# Altium schematic sheet 0264_GPU_VCCGT VREG PHA.SchDoc
size 848 x 558 mm
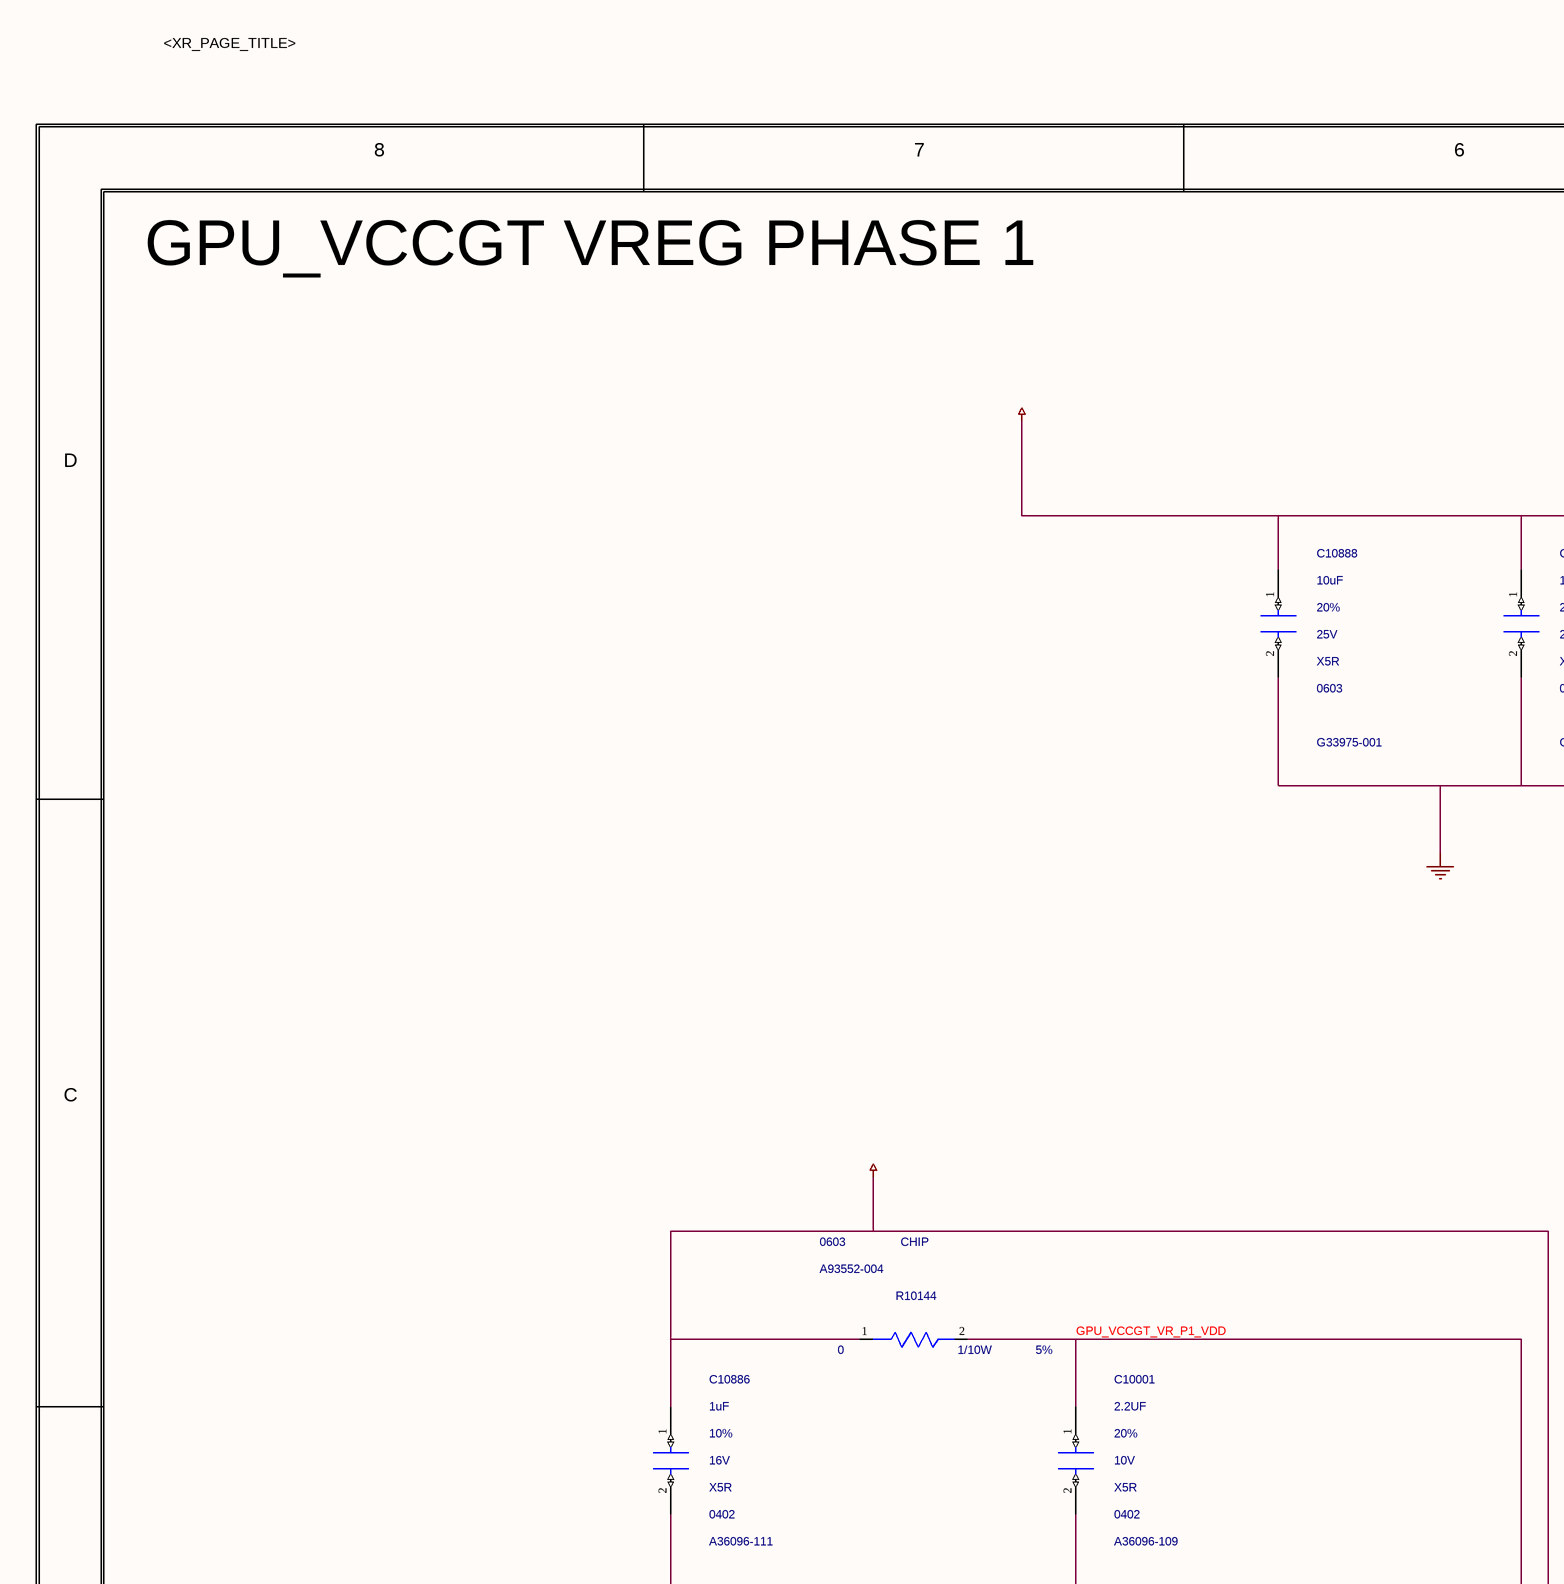
[diagram p0: 0264_GPU_VCCGT VREG PHA.SchDoc, top left]
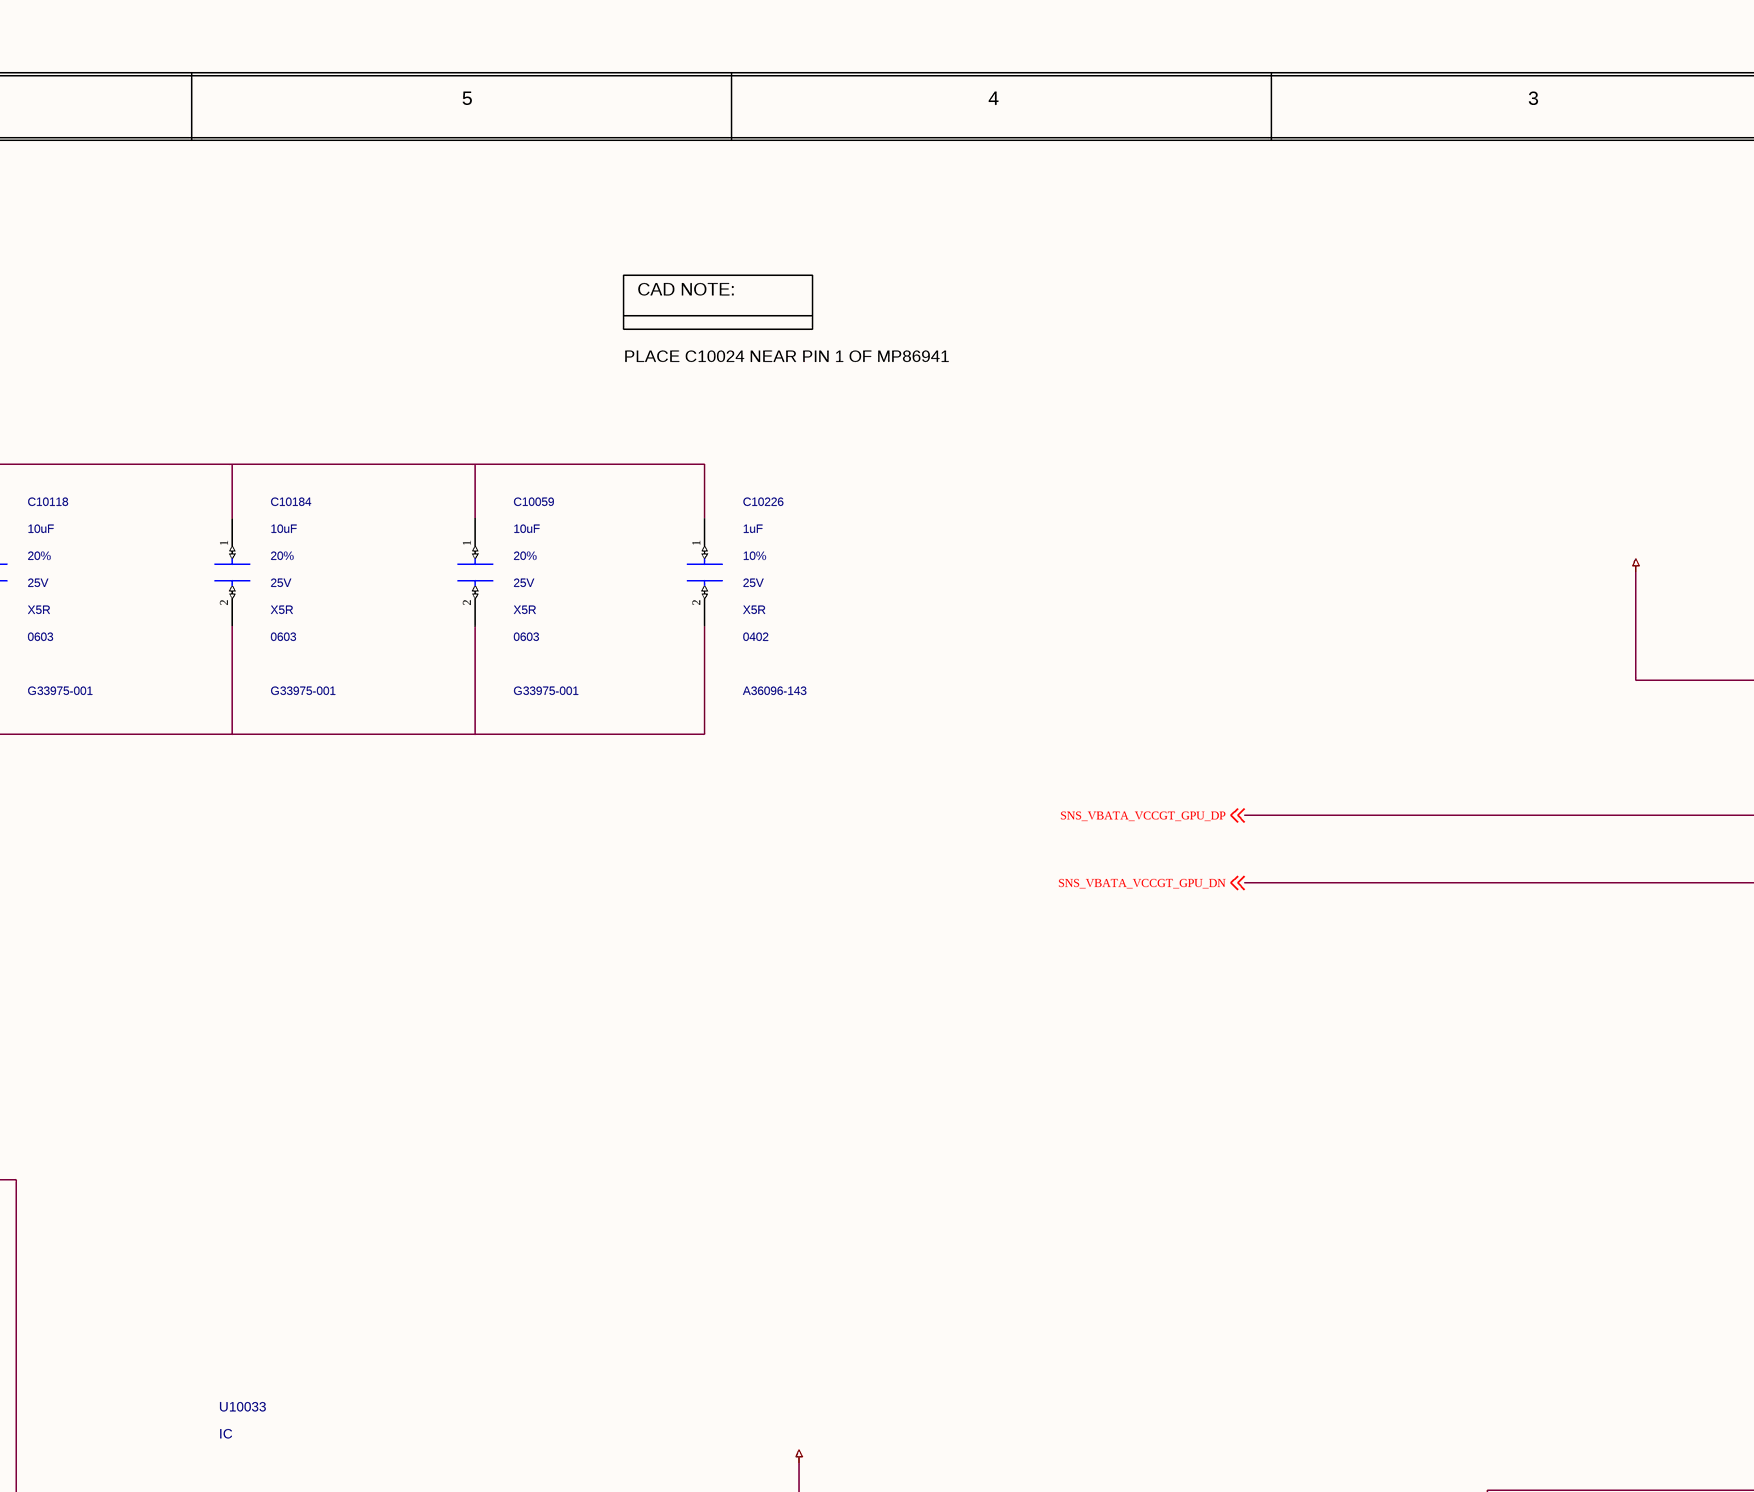
[diagram p1: 0264_GPU_VCCGT VREG PHA.SchDoc, top middle]
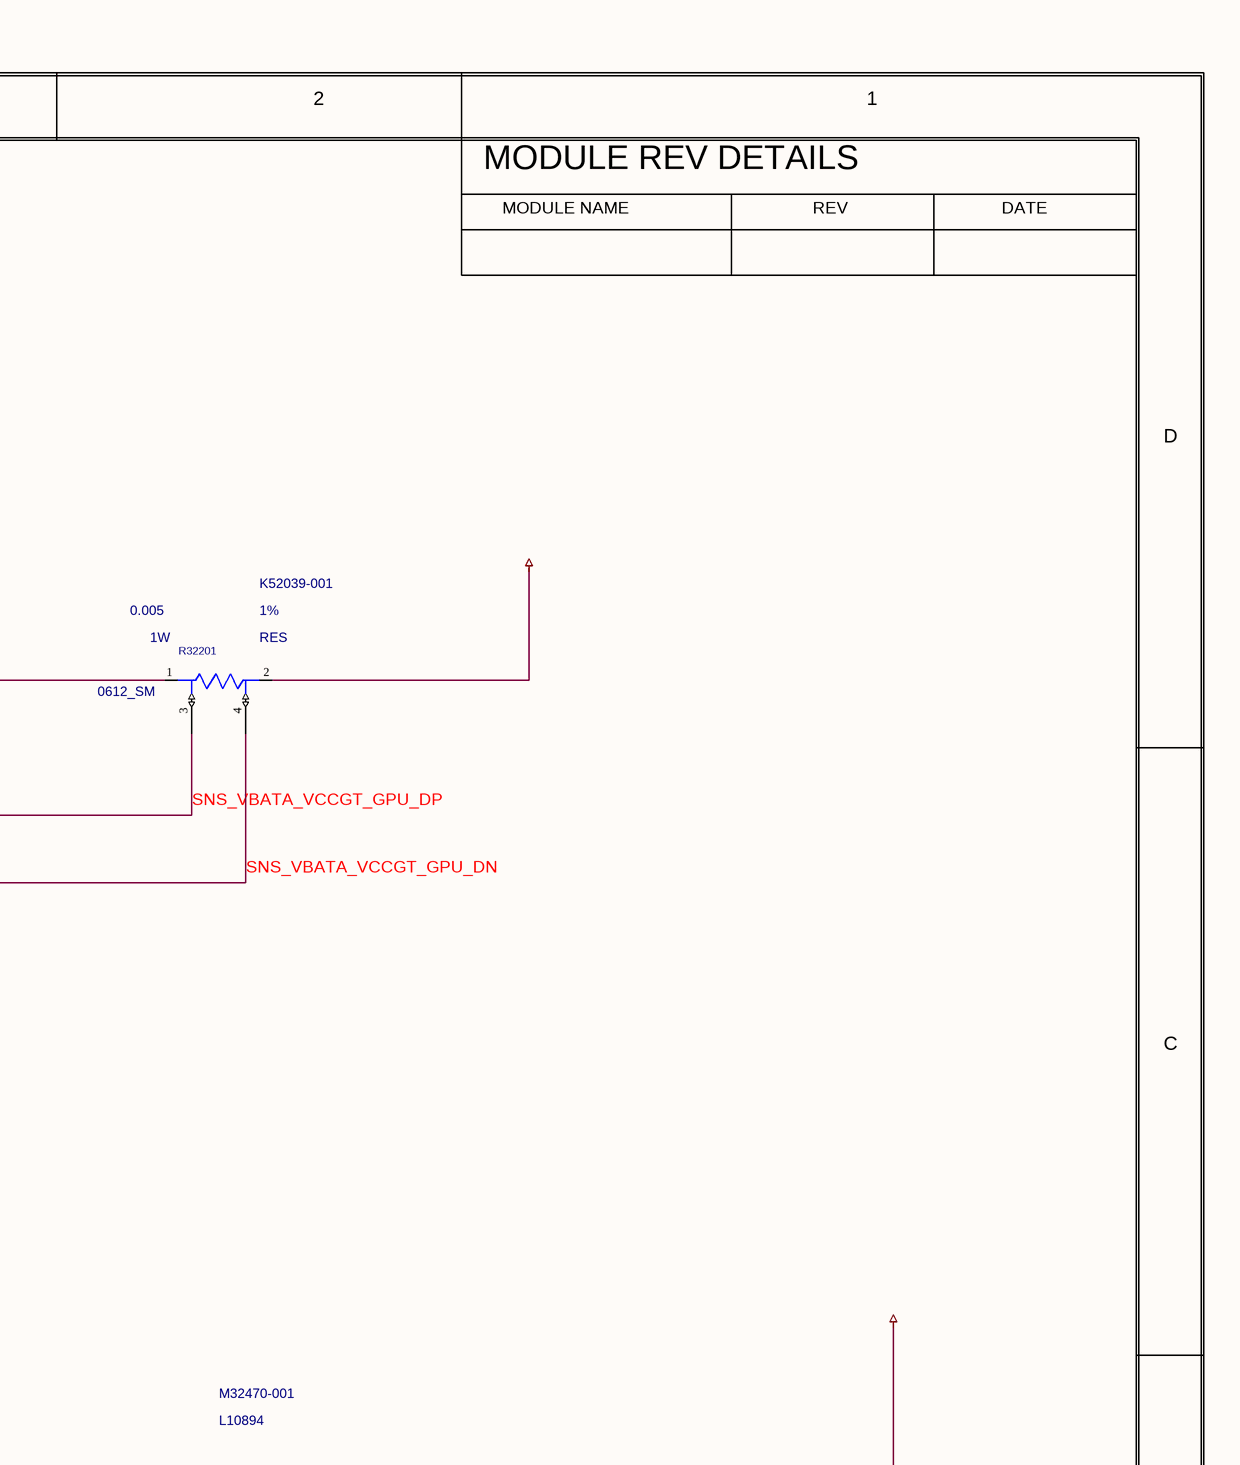
[diagram p2: 0264_GPU_VCCGT VREG PHA.SchDoc, top right]
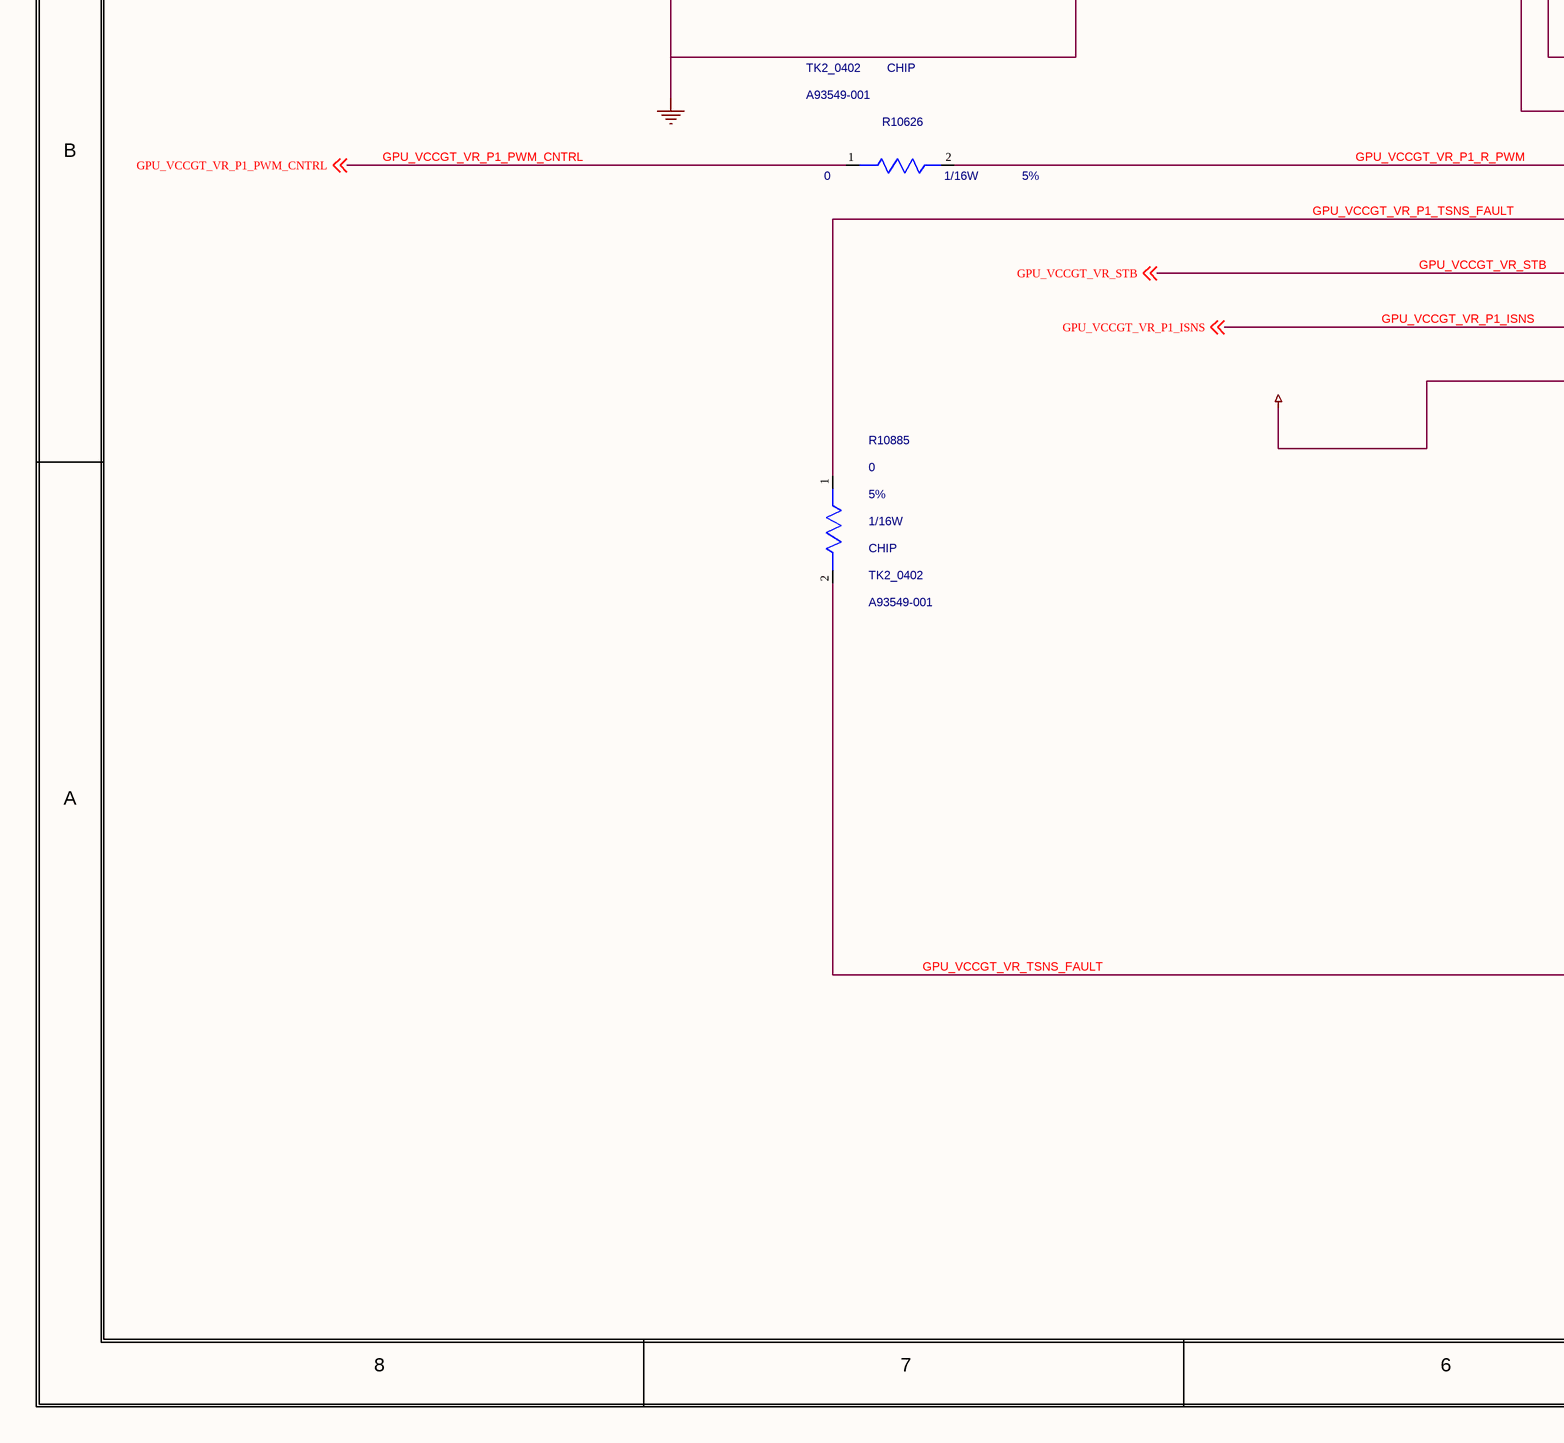
[diagram p3: 0264_GPU_VCCGT VREG PHA.SchDoc, bottom left]
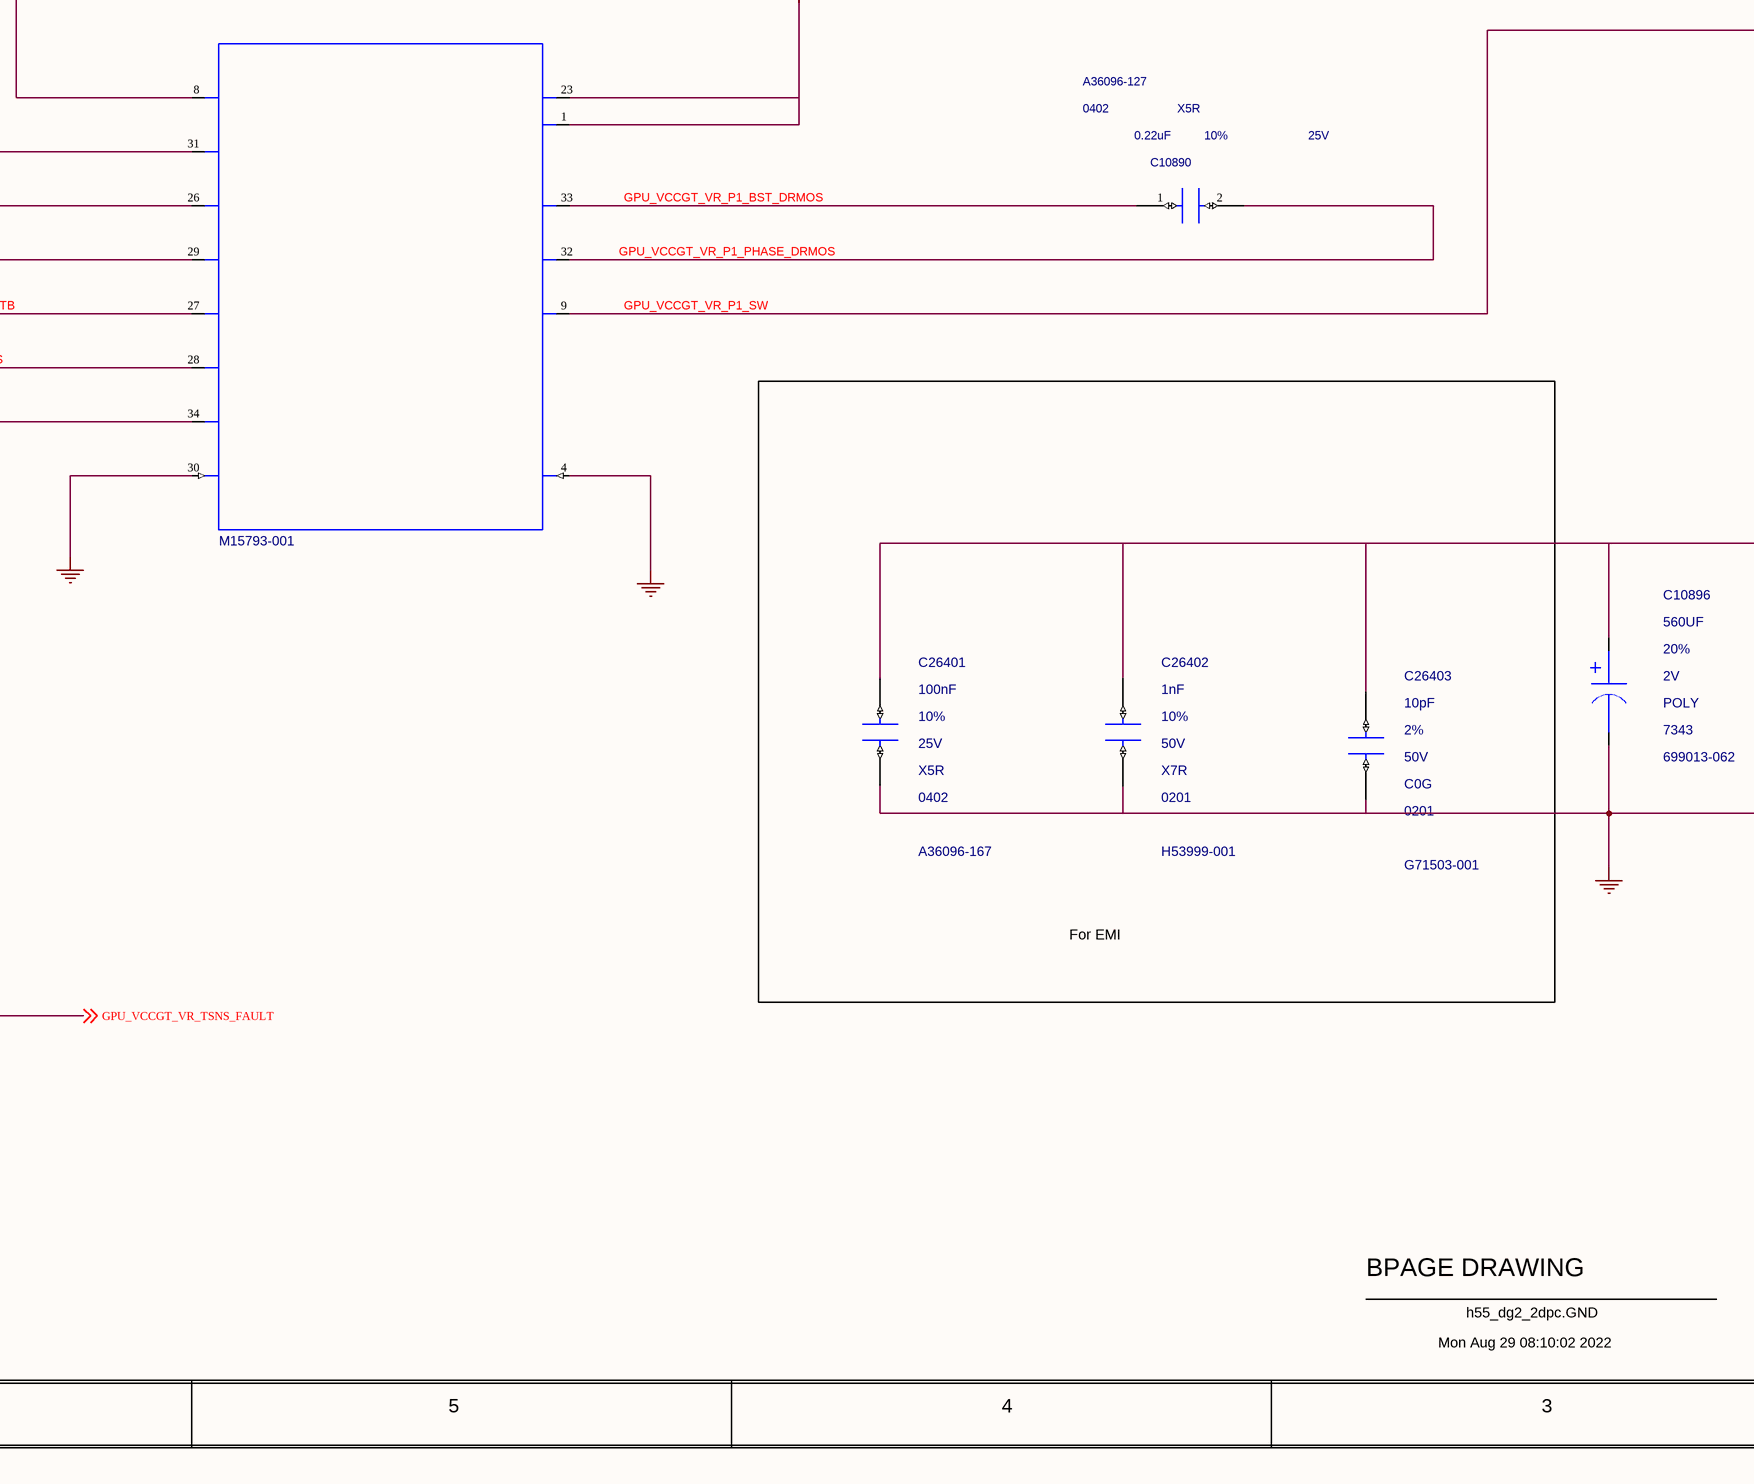
[diagram p4: 0264_GPU_VCCGT VREG PHA.SchDoc, bottom middle]
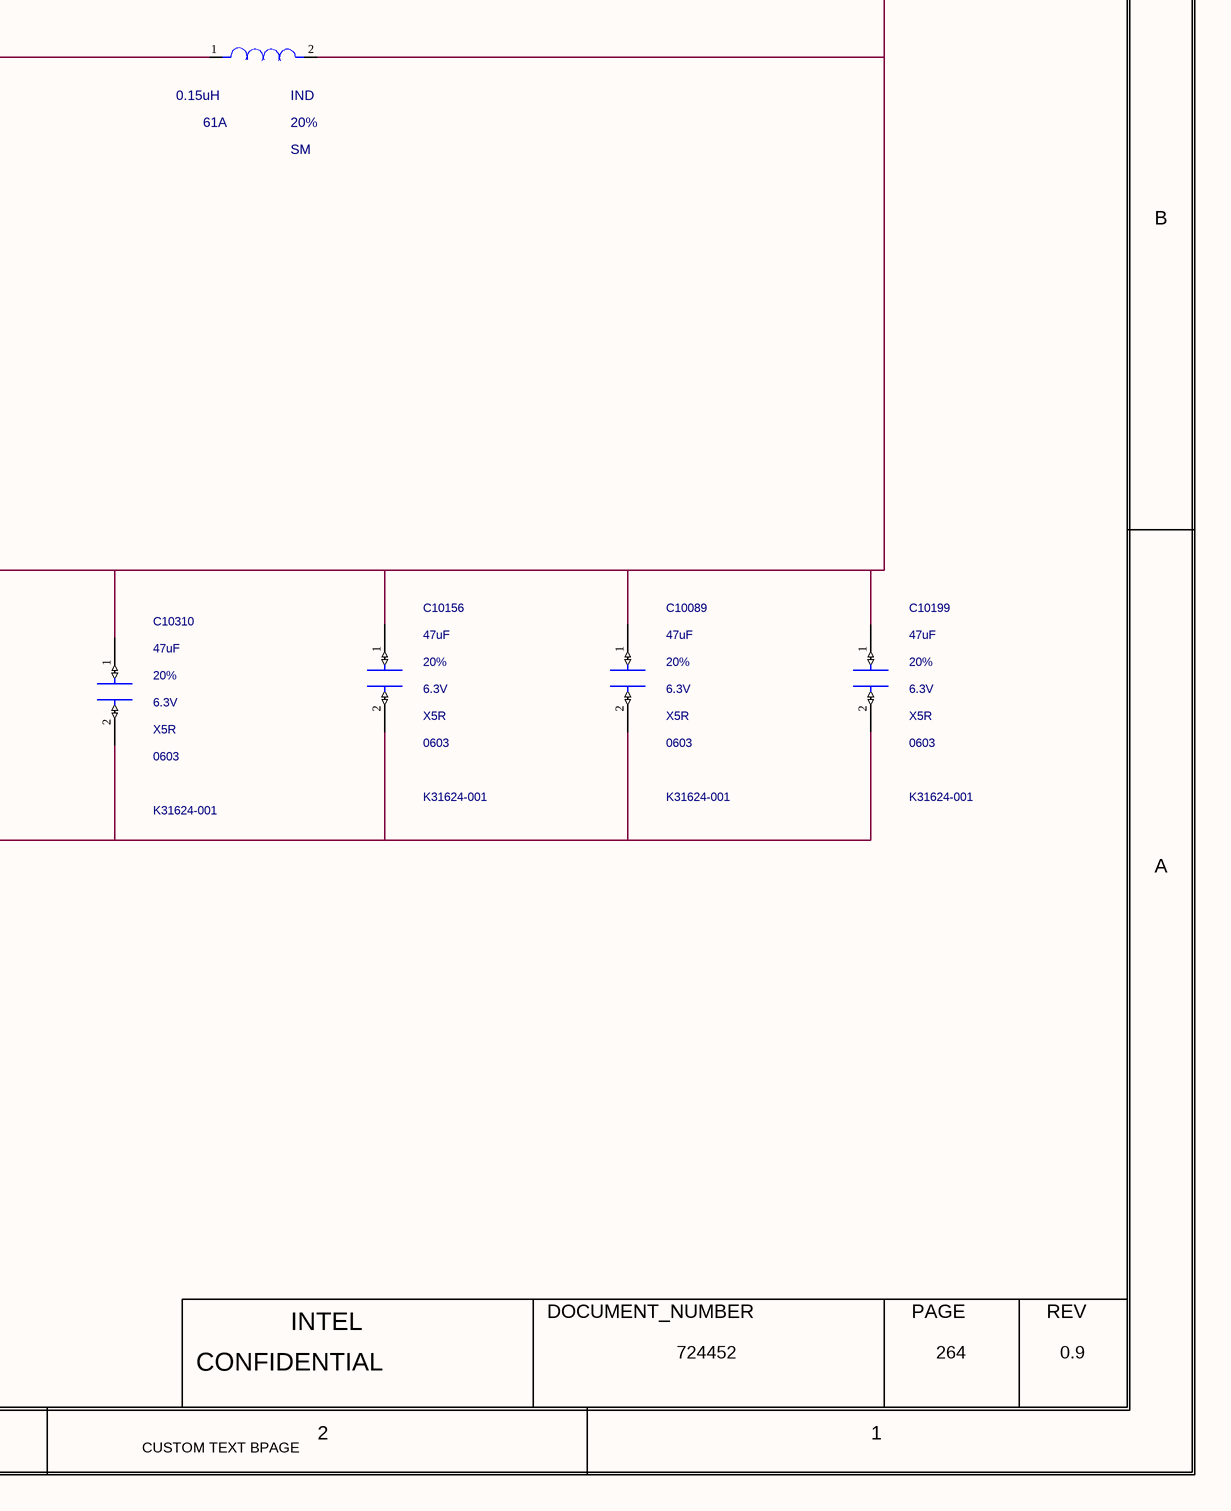
[diagram p5: 0264_GPU_VCCGT VREG PHA.SchDoc, bottom right]

## Parts
C10001  2.2UF  MATERIAL: X5R  PACK_TYPE: 0402  PART_NUMBER: A36096-109  TOLERANCE: 20%  VOLTAGE: 10V  [SMC0402IA]
C10059  10uF  MATERIAL: X5R  PACK_TYPE: 0603  PART_NUMBER: G33975-001  TOLERANCE: 20%  VOLTAGE: 25V  [SMC0603IA]
C10089  47uF  MATERIAL: X5R  PACK_TYPE: 0603  PART_NUMBER: K31624-001  TOLERANCE: 20%  VOLTAGE: 6.3V  [SMC0603ID]
C10118  10uF  MATERIAL: X5R  PACK_TYPE: 0603  PART_NUMBER: G33975-001  TOLERANCE: 20%  VOLTAGE: 25V  [SMC0603IA]
C10156  47uF  MATERIAL: X5R  PACK_TYPE: 0603  PART_NUMBER: K31624-001  TOLERANCE: 20%  VOLTAGE: 6.3V  [SMC0603ID]
C10184  10uF  MATERIAL: X5R  PACK_TYPE: 0603  PART_NUMBER: G33975-001  TOLERANCE: 20%  VOLTAGE: 25V  [SMC0603IA]
C10199  47uF  MATERIAL: X5R  PACK_TYPE: 0603  PART_NUMBER: K31624-001  TOLERANCE: 20%  VOLTAGE: 6.3V  [SMC0603ID]
C10226  1uF  MATERIAL: X5R  PACK_TYPE: 0402  PART_NUMBER: A36096-143  TOLERANCE: 10%  VOLTAGE: 25V  [SMC0402MA]
C10310  47uF  MATERIAL: X5R  PACK_TYPE: 0603  PART_NUMBER: K31624-001  TOLERANCE: 20%  VOLTAGE: 6.3V  [SMC0603ID]
C10886  1uF  MATERIAL: X5R  PACK_TYPE: 0402  PART_NUMBER: A36096-111  TOLERANCE: 10%  VOLTAGE: 16V  [SMC0402IA]
C10888  10uF  MATERIAL: X5R  PACK_TYPE: 0603  PART_NUMBER: G33975-001  TOLERANCE: 20%  VOLTAGE: 25V  [SMC0603IA]
C10890  0.22uF  MATERIAL: X5R  PACK_TYPE: 0402  PART_NUMBER: A36096-127  TOLERANCE: 10%  VOLTAGE: 25V  [SMC1005MB]
C10896  560UF  MATERIAL: POLY  PACK_TYPE: 7343  PART_NUMBER: 699013-062  TOLERANCE: 20%  VOLTAGE: 2V  [CTK0_SMC7343M_7500X4500_TANT_MA]
C26401  100nF  MATERIAL: X5R  PACK_TYPE: 0402  PART_NUMBER: A36096-167  TOLERANCE: 10%  VOLTAGE: 25V  [CTK2_SM0402_1050X550_MA]
C26402  1nF  MATERIAL: X7R  PACK_TYPE: 0201  PART_NUMBER: H53999-001  TOLERANCE: 10%  VOLTAGE: 50V  [CTK2_SM0201_630X330_MA]
C26403  10pF  MATERIAL: C0G  PACK_TYPE: 0201  PART_NUMBER: G71503-001  TOLERANCE: 2%  VOLTAGE: 50V  [CTK2_SM0201_630X330_MA]
L10894  0.15uH  CURRENT: 61A  MATERIAL: IND  PACK_TYPE: SM  PART_NUMBER: M32470-001  TOLERANCE: 20%  [CTK2_SM_7300X6800_MA]
R10144  0  MATERIAL: CHIP  PACK_TYPE: 0603  PART_NUMBER: A93552-004  TOLERANCE: 5%  WATTAGE: 1/10W  [SMR0603IA]
R10626  0  MATERIAL: CHIP  PACK_TYPE: TK2_0402  PART_NUMBER: A93549-001  TOLERANCE: 5%  WATTAGE: 1/16W  [SMR1005MB]
R10885  0  MATERIAL: CHIP  PACK_TYPE: TK2_0402  PART_NUMBER: A93549-001  TOLERANCE: 5%  WATTAGE: 1/16W  [SMR1005MB]
R32201  0.005  MATERIAL: RES  PACK_TYPE: 0612_SM  PART_NUMBER: K52039-001  TOLERANCE: 1%  WATTAGE: 1W  [CTK0_SMR4_0612_1800X3450_MB_VR]
U10033  MATERIAL: IC  PART_NUMBER: M15793-001  [CTK1_LCC34_4100X6100_450_DF4P_MA_VR]  (hidden comment: C_MP86959)

## Blocks framed on the sheet
For EMI: C26401-C26403

## Nets
+V3P3S_GPU: C10886.1(A) R10144.1(A) U10033.8(VDRV) U10033.34(TEST)
+VBATA_DG2: R32201.1(PWRA)
+VBATA_VCCGT_GPU: C10059.1(A) C10118.1(A) C10184.1(A) C10226.1(A) C10888.1(A) R32201.2(PWRB) U10033.1(VIN_1) U10033.23(VIN_2)
+VCCGT_GPU: C10089.1(A) C10156.1(A) C10199.1(A) C10310.1(A) C10896.1(A) C26401.1(A) C26402.1(A) C26403.1(A) L10894.2(INB)
GND: C10001.2(B) C10059.2(B) C10089.2(B) C10118.2(B) C10156.2(B) C10184.2(B) C10199.2(B) C10226.2(B) C10310.2(B) C10886.2(B) C10888.2(B) C10896.2(B) C26401.2(B) C26402.2(B) C26403.2(B) U10033.4(PGND) U10033.30(AGND)
GPU_VCCGT_VR_P1_BST_DRMOS: C10890.1(A) U10033.33(BST)
GPU_VCCGT_VR_P1_ISNS: U10033.28(CS) ; off-sheet GPU_VCCGT_VR_P1_ISNS
GPU_VCCGT_VR_P1_PHASE_DRMOS: C10890.2(B) U10033.32(PHASE)
GPU_VCCGT_VR_P1_PWM_CNTRL: R10626.1(A) ; off-sheet GPU_VCCGT_VR_P1_PWM_CNTRL
GPU_VCCGT_VR_P1_R_PWM: R10626.2(B) U10033.26(PWM)
GPU_VCCGT_VR_P1_SW: L10894.1(INA) U10033.9(SW)
GPU_VCCGT_VR_P1_TSNS_FAULT: R10885.1(A) U10033.29(VTEMP_FLT)
GPU_VCCGT_VR_P1_VDD: C10001.1(A) R10144.2(B) U10033.31(VDD)
GPU_VCCGT_VR_STB: U10033.27(SYNC) ; off-sheet GPU_VCCGT_VR_STB
GPU_VCCGT_VR_TSNS_FAULT: R10885.2(B) ; off-sheet GPU_VCCGT_VR_TSNS_FAULT
SNS_VBATA_VCCGT_GPU_DN: R32201.4(SENB) ; off-sheet SNS_VBATA_VCCGT_GPU_DN
SNS_VBATA_VCCGT_GPU_DP: R32201.3(SENA) ; off-sheet SNS_VBATA_VCCGT_GPU_DP

## Notes on the sheet
- <XR_PAGE_TITLE>
- 8
- 7
- 6
- 5
- 4
- 3
- 2
- 1
- MODULE REV DETAILS
- GPU_VCCGT VREG PHASE 1
- MODULE NAME
- REV
- DATE
- CAD NOTE:
- PLACE C10024 NEAR PIN 1 OF MP86941
- D
- C
- B
- A
- BPAGE DRAWING
- INTEL
- DOCUMENT_NUMBER
- PAGE
- Mon Aug 29 08:10:02 2022
- h55_dg2_2dpc.GND
- CONFIDENTIAL
- 724452
- 264
- 0.9
- CUSTOM TEXT BPAGE

## Library data of the parts
C10001 = CAP: CDS_PHYS_PART_NAME: CAP_0402-A36096-109,X5R,2.2UF,10V,20%,LPDB,GENERIC; OriginalSymbolOrigin: (-50,25); XY: (-6200,2650); VER: 1; ROT: 0; PHYS_PAGE: 264; LOCATION: C10001; DRAWING: @RVP1_ADL_SB_ADP_S_DDR5_SODIMM_2DPC_LIB.H55_DG2_2DPC(SCH_1):PAGE437; CDS_LIB: discrete; PCB Footprint: SMC0402IA; CHIPS_PART_NAME: CAP; CDS_PART_NAME: CAP_0402-A36096-109,X5R,2.2UF,10V,20%,LPDB,GENERIC; CDS_LOCATION: C10001
C10059 = CAP: CDS_PHYS_PART_NAME: CAP_0603-G33975-001,X5R,10UF,25V,20%,LPDB,GENERIC; OriginalSymbolOrigin: (-50,25); XY: (-4475,4200); VER: 1; ROT: 0; PHYS_PAGE: 264; LOCATION: C10059; DRAWING: @RVP1_ADL_SB_ADP_S_DDR5_SODIMM_2DPC_LIB.H55_DG2_2DPC(SCH_1):PAGE437; CDS_LIB: discrete; PCB Footprint: SMC0603IA; CHIPS_PART_NAME: CAP; CDS_PART_NAME: CAP_0603-G33975-001,X5R,10UF,25V,20%,LPDB,GENERIC; CDS_LOCATION: C10059
C10089 = CAP: CDS_PHYS_PART_NAME: CAP_0603-K31624-001,X5R,47UF,6.3V,20%,LPDB,GENERIC; OriginalSymbolOrigin: (-50,25); XY: (-925,1350); VER: 1; ROT: 0; PHYS_PAGE: 264; LOCATION: C10089; DRAWING: @RVP1_ADL_SB_ADP_S_DDR5_SODIMM_2DPC_LIB.H55_DG2_2DPC(SCH_1):PAGE437; CDS_LIB: discrete; PCB Footprint: SMC0603ID; CHIPS_PART_NAME: CAP; CDS_PART_NAME: CAP_0603-K31624-001,X5R,47UF,6.3V,20%,LPDB,GENERIC; CDS_LOCATION: C10089
C10118 = CAP: CDS_PHYS_PART_NAME: CAP_0603-G33975-001,X5R,10UF,25V,20%,LPDB,GENERIC; OriginalSymbolOrigin: (-50,25); XY: (-5375,4200); VER: 1; ROT: 0; PHYS_PAGE: 264; LOCATION: C10118; DRAWING: @RVP1_ADL_SB_ADP_S_DDR5_SODIMM_2DPC_LIB.H55_DG2_2DPC(SCH_1):PAGE437; CDS_LIB: discrete; PCB Footprint: SMC0603IA; CHIPS_PART_NAME: CAP; CDS_PART_NAME: CAP_0603-G33975-001,X5R,10UF,25V,20%,LPDB,GENERIC; CDS_LOCATION: C10118
C10156 = CAP: CDS_PHYS_PART_NAME: CAP_0603-K31624-001,X5R,47UF,6.3V,20%,LPDB,GENERIC; OriginalSymbolOrigin: (-50,25); XY: (-1375,1350); VER: 1; ROT: 0; PHYS_PAGE: 264; LOCATION: C10156; DRAWING: @RVP1_ADL_SB_ADP_S_DDR5_SODIMM_2DPC_LIB.H55_DG2_2DPC(SCH_1):PAGE437; CDS_LIB: discrete; PCB Footprint: SMC0603ID; CHIPS_PART_NAME: CAP; CDS_PART_NAME: CAP_0603-K31624-001,X5R,47UF,6.3V,20%,LPDB,GENERIC; CDS_LOCATION: C10156
C10184 = CAP: CDS_PHYS_PART_NAME: CAP_0603-G33975-001,X5R,10UF,25V,20%,LPDB,GENERIC; OriginalSymbolOrigin: (-50,25); XY: (-4925,4200); VER: 1; ROT: 0; PHYS_PAGE: 264; LOCATION: C10184; DRAWING: @RVP1_ADL_SB_ADP_S_DDR5_SODIMM_2DPC_LIB.H55_DG2_2DPC(SCH_1):PAGE437; CDS_LIB: discrete; PCB Footprint: SMC0603IA; CHIPS_PART_NAME: CAP; CDS_PART_NAME: CAP_0603-G33975-001,X5R,10UF,25V,20%,LPDB,GENERIC; CDS_LOCATION: C10184
C10199 = CAP: CDS_PHYS_PART_NAME: CAP_0603-K31624-001,X5R,47UF,6.3V,20%,LPDB,GENERIC; OriginalSymbolOrigin: (-50,25); XY: (-475,1350); VER: 1; ROT: 0; PHYS_PAGE: 264; LOCATION: C10199; DRAWING: @RVP1_ADL_SB_ADP_S_DDR5_SODIMM_2DPC_LIB.H55_DG2_2DPC(SCH_1):PAGE437; CDS_LIB: discrete; PCB Footprint: SMC0603ID; CHIPS_PART_NAME: CAP; CDS_PART_NAME: CAP_0603-K31624-001,X5R,47UF,6.3V,20%,LPDB,GENERIC; CDS_LOCATION: C10199
C10226 = CAP: CDS_PHYS_PART_NAME: CAP_0402-A36096-143,X5R,1UF,25V,10%,LPDB,GENERIC; OriginalSymbolOrigin: (-50,25); XY: (-4050,4200); VER: 1; ROT: 0; PHYS_PAGE: 264; LOCATION: C10226; DRAWING: @RVP1_ADL_SB_ADP_S_DDR5_SODIMM_2DPC_LIB.H55_DG2_2DPC(SCH_1):PAGE437; CDS_LIB: discrete; PCB Footprint: SMC0402MA; CHIPS_PART_NAME: CAP; CDS_PART_NAME: CAP_0402-A36096-143,X5R,1UF,25V,10%,LPDB,GENERIC; CDS_LOCATION: C10226
C10310 = CAP: CDS_PHYS_PART_NAME: CAP_0603-K31624-001,X5R,47UF,6.3V,20%,LPDB,GENERIC; OriginalSymbolOrigin: (-50,25); XY: (-1875,1325); VER: 1; ROT: 0; PHYS_PAGE: 264; LOCATION: C10310; DRAWING: @RVP1_ADL_SB_ADP_S_DDR5_SODIMM_2DPC_LIB.H55_DG2_2DPC(SCH_1):PAGE437; CDS_LIB: discrete; PCB Footprint: SMC0603ID; CHIPS_PART_NAME: CAP; CDS_PART_NAME: CAP_0603-K31624-001,X5R,47UF,6.3V,20%,LPDB,GENERIC; CDS_LOCATION: C10310
C10886 = CAP: CDS_PHYS_PART_NAME: CAP_0402-A36096-111,X5R,1UF,16V,10%,LPDB,GENERIC; OriginalSymbolOrigin: (-50,25); XY: (-6950,2650); VER: 1; ROT: 0; PHYS_PAGE: 264; LOCATION: C10886; DRAWING: @RVP1_ADL_SB_ADP_S_DDR5_SODIMM_2DPC_LIB.H55_DG2_2DPC(SCH_1):PAGE437; CDS_LIB: discrete; PCB Footprint: SMC0402IA; CHIPS_PART_NAME: CAP; CDS_PART_NAME: CAP_0402-A36096-111,X5R,1UF,16V,10%,LPDB,GENERIC; CDS_LOCATION: C10886
C10888 = CAP: CDS_PHYS_PART_NAME: CAP_0603-G33975-001,X5R,10UF,25V,20%,LPDB,GENERIC; OriginalSymbolOrigin: (-50,25); XY: (-5825,4200); VER: 1; ROT: 0; PHYS_PAGE: 264; LOCATION: C10888; DRAWING: @RVP1_ADL_SB_ADP_S_DDR5_SODIMM_2DPC_LIB.H55_DG2_2DPC(SCH_1):PAGE437; CDS_LIB: discrete; PCB Footprint: SMC0603IA; CHIPS_PART_NAME: CAP; CDS_PART_NAME: CAP_0603-G33975-001,X5R,10UF,25V,20%,LPDB,GENERIC; CDS_LOCATION: C10888
C10890 = CAP#1: CHIPS_PART_NAME: CAP; CDS_PHYS_PART_NAME: CAP_0402-A36096-127,X5R,0.22UF,25V,10%,LPDB,GENERIC; OriginalSymbolOrigin: (-25,50); XY: (-3150,2175); VER: 2; ROT: 0; PHYS_PAGE: 264; LOCATION: C10890; DRAWING: @RVP1_ADL_SB_ADP_S_DDR5_SODIMM_2DPC_LIB.H55_DG2_2DPC(SCH_1):PAGE437; CDS_LIB: discrete; PCB Footprint: SMC1005MB; CDS_PART_NAME: CAP_0402-A36096-127,X5R,0.22UF,25V,10%,LPDB,GENERIC; CDS_LOCATION: C10890
C10896 = C_CAPP: CDS_PHYS_PART_NAME: C_CAPP_7343-699013-062,POLY,560UF,2V,20%,TK0,GENERIC; CDS_LMAN_SYM_OUTLINE: -50,100,50,-50; FP_TECH: TK0; IP: GENERIC; ROOM: NONE; OriginalSymbolOrigin: (-50,75); XY: (-2375,1275); VER: 1; ROT: 0; PHYS_PAGE: 264; LOCATION: C10896; DRAWING: @RVP1_ADL_SB_ADP_S_DDR5_SODIMM_2DPC_LIB.H55_DG2_2DPC(SCH_1):PAGE437; CDS_LIB: c_discrete; VARIANT: ?; PCB Footprint: CTK0_SMC7343M_7500X4500_TANT_MA; CHIPS_PART_NAME: C_CAPP; CDS_PART_NAME: C_CAPP_7343-699013-062,POLY,560UF,2V,20%,TK0,GENERIC; CDS_LOCATION: C10896
C26401 = C_CAP: CDS_PHYS_PART_NAME: C_CAP_0402-A36096-167,X5R,100NF,25V,10%,TK2,GENERIC; CDS_LMAN_SYM_OUTLINE: -50,50,50,-50; FP_TECH: TK2; IP: GENERIC; ROOM: NONE; OriginalSymbolOrigin: (-50,25); XY: (-3725,1200); VER: 1; ROT: 0; PHYS_PAGE: 264; LOCATION: C26401; DRAWING: @RVP1_ADL_SB_ADP_S_DDR5_SODIMM_2DPC_LIB.H55_DG2_2DPC(SCH_1):PAGE437; CDS_LIB: c_discrete; VARIANT: ?; PCB Footprint: CTK2_SM0402_1050X550_MA; CHIPS_PART_NAME: C_CAP; CDS_PART_NAME: C_CAP_0402-A36096-167,X5R,100NF,25V,10%,TK2,GENERIC; CDS_LOCATION: C26401
C26402 = C_CAP: CDS_PHYS_PART_NAME: C_CAP_0201-H53999-001,X7R,1NF,50V,10%,TK2,GENERIC; CDS_LMAN_SYM_OUTLINE: -50,50,50,-50; FP_TECH: TK2; IP: GENERIC; ROOM: NONE; OriginalSymbolOrigin: (-50,25); XY: (-3275,1200); VER: 1; ROT: 0; PHYS_PAGE: 264; LOCATION: C26402; DRAWING: @RVP1_ADL_SB_ADP_S_DDR5_SODIMM_2DPC_LIB.H55_DG2_2DPC(SCH_1):PAGE437; CDS_LIB: c_discrete; VARIANT: ?; PCB Footprint: CTK2_SM0201_630X330_MA; CHIPS_PART_NAME: C_CAP; CDS_PART_NAME: C_CAP_0201-H53999-001,X7R,1NF,50V,10%,TK2,GENERIC; CDS_LOCATION: C26402
C26403 = C_CAP: CDS_PHYS_PART_NAME: C_CAP_0201-G71503-001,C0G,10PF,50V,2%,TK2,GENERIC; CDS_LMAN_SYM_OUTLINE: -50,50,50,-50; FP_TECH: TK2; IP: GENERIC; ROOM: NONE; OriginalSymbolOrigin: (-50,25); XY: (-2825,1175); VER: 1; ROT: 0; PHYS_PAGE: 264; LOCATION: C26403; DRAWING: @RVP1_ADL_SB_ADP_S_DDR5_SODIMM_2DPC_LIB.H55_DG2_2DPC(SCH_1):PAGE437; CDS_LIB: c_discrete; VARIANT: ?; PCB Footprint: CTK2_SM0201_630X330_MA; CHIPS_PART_NAME: C_CAP; CDS_PART_NAME: C_CAP_0201-G71503-001,C0G,10PF,50V,2%,TK2,GENERIC; CDS_LOCATION: C26403
L10894 = C_INDUCTOR: CDS_PHYS_PART_NAME: C_INDUCTOR_SM-M32470-001,IND,0.15UH,20%,61A,TK2,GENERIC; CDS_LMAN_SYM_OUTLINE: -100,50,100,-50; FP_TECH: TK2; IP: GENERIC; ROOM: NONE; OriginalSymbolOrigin: (-75,25); XY: (-1600,2500); VER: 1; ROT: 0; PHYS_PAGE: 264; LOCATION: L10894; DRAWING: @RVP1_ADL_SB_ADP_S_DDR5_SODIMM_2DPC_LIB.H55_DG2_2DPC(SCH_1):PAGE437; CDS_LIB: local; VARIANT: ?; PCB Footprint: CTK2_SM_7300X6800_MA; CHIPS_PART_NAME: C_INDUCTOR; CDS_PART_NAME: C_INDUCTOR_SM-M32470-001,IND,0.15UH,20%,61A,TK2,GENERIC; CDS_LOCATION: L10894
R10144 = RES#1: CHIPS_PART_NAME: RES; CDS_PHYS_PART_NAME: RES_0603-A93552-004,CHIP,0,5%,1/10W,LPDB,GENERIC; OriginalSymbolOrigin: (-75,25); XY: (-6500,2875); VER: 1; PHYS_PAGE: 264; LOCATION: R10144; IP: GENERIC; FP_TECH: LPDB; DRAWING: @RVP1_ADL_SB_ADP_S_DDR5_SODIMM_2DPC_LIB.H55_DG2_2DPC(SCH_1):PAGE437; CDS_LIB: discrete; PCB Footprint: SMR0603IA; ROT: 0; CDS_PART_NAME: RES_0603-A93552-004,CHIP,0,5%,1/10W,LPDB,GENERIC; CDS_LOCATION: R10144
R10626 = RES#1: CHIPS_PART_NAME: RES; CDS_PHYS_PART_NAME: RES_TK2_0402-A93549-001,CHIP,0,5%,1/16W,TK2,GENERIC; OriginalSymbolOrigin: (-75,25); XY: (-6525,2175); VER: 1; PHYS_PAGE: 264; LOCATION: R10626; IP: GENERIC; FP_TECH: TK2; DRAWING: @RVP1_ADL_SB_ADP_S_DDR5_SODIMM_2DPC_LIB.H55_DG2_2DPC(SCH_1):PAGE437; CDS_LIB: discrete; PCB Footprint: SMR1005MB; ROT: 0; CDS_PART_NAME: RES_TK2_0402-A93549-001,CHIP,0,5%,1/16W,TK2,GENERIC; CDS_LOCATION: R10626
R10885 = RES: CDS_PHYS_PART_NAME: RES_TK2_0402-A93549-001,CHIP,0,5%,1/16W,TK2,GENERIC; OriginalSymbolOrigin: (-25,75); XY: (-6650,1500); VER: 2; SUB_ROOM: VCCSA; PHYS_PAGE: 264; LOCATION: R10885; IP: GENERIC; FP_TECH: TK2; DRAWING: @RVP1_ADL_SB_ADP_S_DDR5_SODIMM_2DPC_LIB.H55_DG2_2DPC(SCH_1):PAGE437; CDS_LIB: discrete; PCB Footprint: SMR1005MB; ROT: 0; CHIPS_PART_NAME: RES; CDS_PART_NAME: RES_TK2_0402-A93549-001,CHIP,0,5%,1/16W,TK2,GENERIC; CDS_LOCATION: R10885
R32201 = C_RES_4TERM: CDS_PHYS_PART_NAME: C_RES_4TERM_0612_SM-K52039-001,RES,0.005,1%,1W,TK0,GENERIC; CDS_LMAN_SYM_OUTLINE: -50,50,50,-50; FP_TECH: TK0; IP: GENERIC; ROOM: NONE; OriginalSymbolOrigin: (-75,25); XY: (-1700,4000); VER: 1; SUB_ROOM_2: PMR; SUB_ROOM_1: V_CHRG_LDO; ROT: 0; PHYS_PAGE: 264; LOCATION: R32201; DRAWING: @RVP1_ADL_SB_ADP_S_DDR5_SODIMM_2DPC_LIB.H55_DG2_2DPC(SCH_1):PAGE437; CDS_LIB: c_discrete; VARIANT: ?; PCB Footprint: CTK0_SMR4_0612_1800X3450_MB_VR; SUB_ROOM: PMR; CHIPS_PART_NAME: C_RES_4TERM; CDS_PART_NAME: C_RES_4TERM_0612_SM-K52039-001,RES,0.005,1%,1W,TK0,GENERIC; CDS_LOCATION: R32201
U10033 = C_MP86959: CDS_PHYS_PART_NAME: C_MP86959_LCC-M15793-001,IC,MP86959GMW,TK1,GENERIC; CDS_LMAN_SYM_OUTLINE: -300,450,300,-450; FP_TECH: TK1; IP: GENERIC; PACK_TYPE: LCC; ROOM: NONE; OriginalSymbolOrigin: (-325,450); XY: (-4650,2025); VER: 1; ROT: 0; PHYS_PAGE: 264; LOCATION: U10033; DRAWING: @RVP1_ADL_SB_ADP_S_DDR5_SODIMM_2DPC_LIB.H55_DG2_2DPC(SCH_1):PAGE437; CDS_LIB: local; VARIANT: ?; PCB Footprint: CTK1_LCC34_4100X6100_450_DF4P_MA_VR; CHIPS_PART_NAME: C_MP86959; CDS_PART_NAME: C_MP86959_LCC-M15793-001,IC,MP86959GMW,TK1,GENERIC; CDS_LOCATION: U10033